# EAGLE design RH005.1 (EAGLE 7.1.0)
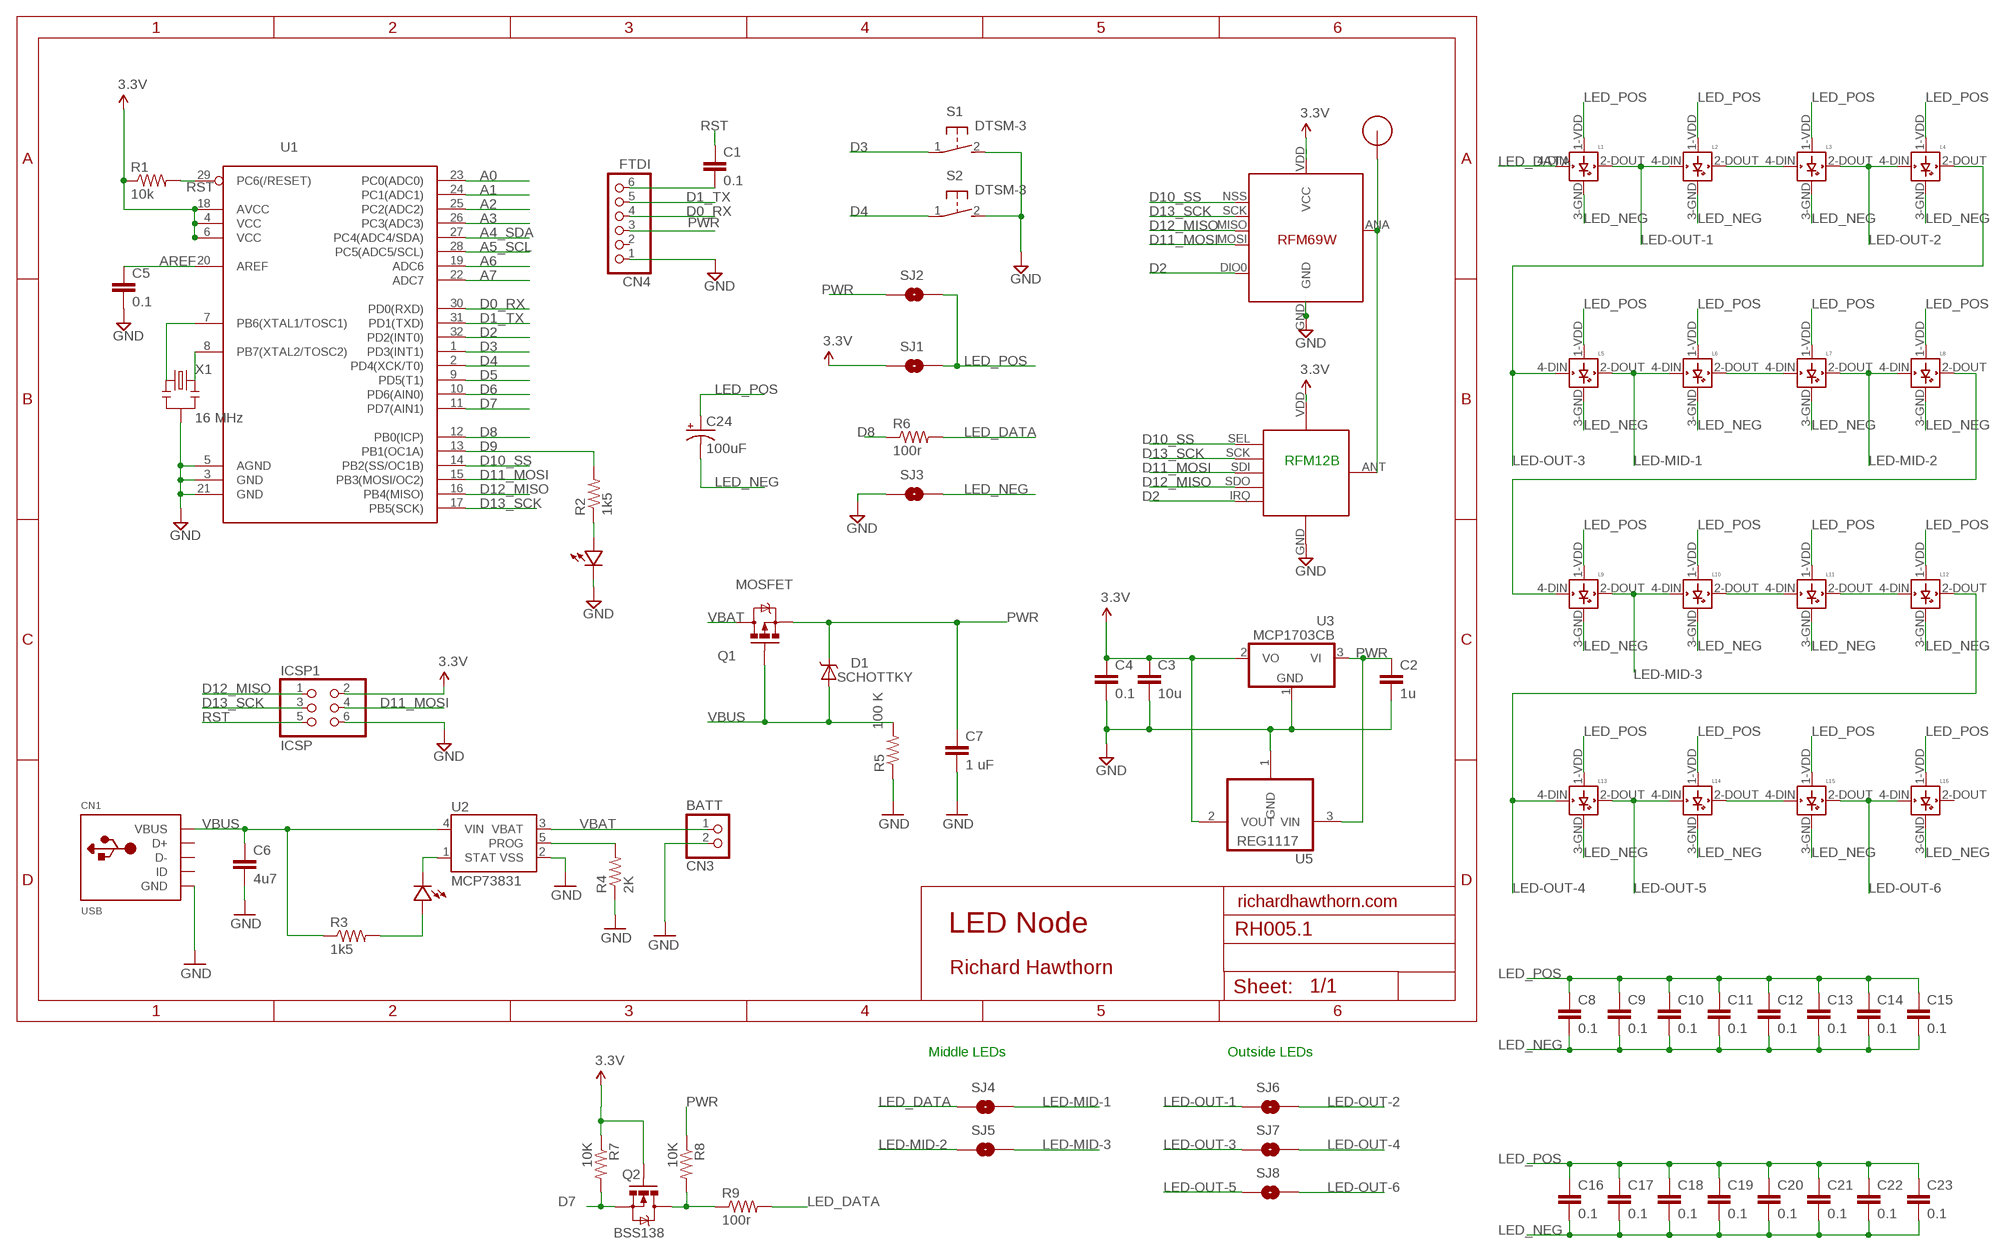
[diagram p0: schematic, sheet 1]

## Parts
C1  0.1  CAP0603-CAP  [0603-CAP]
C2  1u  CAP0603-CAP  [0603-CAP]
C3  10u  CAP0805-CAP  [0805-CAP]
C4  0.1  CAP0603-CAP  [0603-CAP]
C5  0.1  CAP0603-CAP  [0603-CAP]
C6  4u7  CAP0603-CAP  [0603-CAP]
C7  1 uF  CAP0805  [0805]
C8  0.1  CAP0603-CAP  [0603-CAP]
C9  0.1  CAP0603-CAP  [0603-CAP]
C10  0.1  CAP0603-CAP  [0603-CAP]
C11  0.1  CAP0603-CAP  [0603-CAP]
C12  0.1  CAP0603-CAP  [0603-CAP]
C13  0.1  CAP0603-CAP  [0603-CAP]
C14  0.1  CAP0603-CAP  [0603-CAP]
C15  0.1  CAP0603-CAP  [0603-CAP]
C16  0.1  CAP0603-CAP  [0603-CAP]
C17  0.1  CAP0603-CAP  [0603-CAP]
C18  0.1  CAP0603-CAP  [0603-CAP]
C19  0.1  CAP0603-CAP  [0603-CAP]
C20  0.1  CAP0603-CAP  [0603-CAP]
C21  0.1  CAP0603-CAP  [0603-CAP]
C22  0.1  CAP0603-CAP  [0603-CAP]
C23  0.1  CAP0603-CAP  [0603-CAP]
C24  100uF  100UF-10V-10%(TANT)  [EIA7343]
CN1  USB  USBMINIB  [USB-MINIB]
CN3  BATT  JST_2PIN-SMT-RA  [JST-PH-2-SMT-RA]
CN4  FTDI  PINHD-1X6  [1X06]
D1  SCHOTTKY  DIODE-SCHOTTKY_  [SMA-DIODE]
ICSP1  ICSP  PINHD-2X3  [2X03]
L1  WS2812B  [WS2812B]
L2  WS2812B  [WS2812B]
L3  WS2812B  [WS2812B]
L4  WS2812B  [WS2812B]
L5  WS2812B  [WS2812B]
L6  WS2812B  [WS2812B]
L7  WS2812B  [WS2812B]
L8  WS2812B  [WS2812B]
L9  WS2812B  [WS2812B]
L10  WS2812B  [WS2812B]
L11  WS2812B  [WS2812B]
L12  WS2812B  [WS2812B]
L13  WS2812B  [WS2812B]
L14  WS2812B  [WS2812B]
L15  WS2812B  [WS2812B]
L16  WS2812B  [WS2812B]
LED1  LED0603  [0603-LED]
LED2  LED0603  [0603-LED]
Q1  MOSFET  MOSFET-PCHANNELSMD  [SOT23-3]
Q2  BSS138  MOSFET-NCHANNELSMD  [SOT23-3]
R1  10k  RESISTOR0603-RES  [0603-RES]
R2  1k5  RESISTOR0603-RES  [0603-RES]
R3  1k5  RESISTOR0603-RES  [0603-RES]
R4  2K  RESISTOR0603-RES  [0603-RES]
R5  100 K  RESISTOR0805-RES  [0805]
R6  100r  RESISTOR0603-RES  [0603-RES]
R7  10K  RESISTOR0805-RES  [0805]
R8  10K  RESISTOR0805-RES  [0805]
R9  100r  RESISTOR0603-RES  [0603-RES]
RF1  RFM12B  RFM12B_MINPADS  [RFM12B-MINPADS]
RF2  RFM69  [RFM69W-MINPADS]
S1  DTSM-3  [DTSM-3]
S2  DTSM-3  [DTSM-3]
SJ1  SOLDERJUMPERNO  [SJ_2S-NO]
SJ2  SOLDERJUMPERNO  [SJ_2S-NO]
SJ3  SOLDERJUMPERNO  [SJ_2S-NO]
SJ4  JUMPER-PAD-2-NOYES_SILK  [PAD-JUMPER-2-NO_YES_SILK]
SJ5  JUMPER-PAD-2-NOYES_SILK  [PAD-JUMPER-2-NO_YES_SILK]
SJ6  JUMPER-PAD-2-NOYES_SILK  [PAD-JUMPER-2-NO_YES_SILK]
SJ7  JUMPER-PAD-2-NOYES_SILK  [PAD-JUMPER-2-NO_YES_SILK]
SJ8  JUMPER-PAD-2-NOYES_SILK  [PAD-JUMPER-2-NO_YES_SILK]
U1  ATMega-328  ATMEGA168/328TQFP32  [TQFP32-08]
U2  MCP73831  [SOT23-5]
U3  MCP1703CB  [SOT23]
U5  REG1117  [SOT223]
U$1  RFM12B_ANTENNA  [RFM12B-ANTENNA]
X1  16 MHz  RESONATORSMD  [RESONATOR-SMD]

## Nets
A0: U1.23(PC0(ADC0))
A1: U1.24(PC1(ADC1))
A2: U1.25(PC2(ADC2))
A3: U1.26(PC3(ADC3))
A4_SDA: U1.27(PC4(ADC4/SDA))
A5_SCL: U1.28(PC5(ADC5/SCL))
A6: U1.19(ADC6)
A7: U1.22(ADC7)
AREF: C5.1 U1.20(AREF)
D0_RX: CN4.4 U1.30(PD0(RXD))
D1_TX: CN4.5 U1.31(PD1(TXD))
D2: RF1.IRQ RF2.DIO0 U1.32(PD2(INT0))
D3: S1.1 U1.1(PD3(INT1))
D4: S2.1 U1.2(PD4(XCK/T0))
D5: U1.9(PD5(T1))
D6: U1.10(PD6(AIN0))
D7: Q2.2(S) R7.2 U1.11(PD7(AIN1))
D8: R6.1 U1.12(PB0(ICP))
D9: R2.2 U1.13(PB1(OC1A))
D10_SS: RF1.SEL RF2.NSS(SEL) U1.14(PB2(SS/OC1B))
D11_MOSI: ICSP1.4 RF1.SDI(SDI/MOSI) RF2.MOSI U1.15(PB3(MOSI/OC2))
D12_MISO: ICSP1.1 RF1.SDO(SDO/MISO) RF2.MISO U1.16(PB4(MISO))
D13_SCK: ICSP1.3 RF1.SCK RF2.SCK U1.17(PB5(SCK))
GND [power]: C2.2 C3.2 C4.2 C5.2 C6.2 C7.2 CN1.GND CN3.2 CN4.1 ICSP1.6 LED2.MINUS R4.1 R5.1 RF1.GND RF2.GND S1.2 S2.2 SJ3.1 U1.3(GND) U1.5(AGND) U1.21(GND) U2.2(VSS) U3.1(GND) U5.1(GND) X1.2
HV_LED: Q2.3(D) R8.2 R9.1
LED-MID-1: L5.2-DOUT(DOUT) L6.4-DIN(DIN) SJ4.2
LED-MID-2: L7.2-DOUT(DOUT) L8.4-DIN(DIN) SJ5.1
LED-MID-3: L9.2-DOUT(DOUT) L10.4-DIN(DIN) SJ5.2
LED-OUT-1: L1.2-DOUT(DOUT) L2.4-DIN(DIN) SJ6.1
LED-OUT-2: L3.2-DOUT(DOUT) L4.4-DIN(DIN) SJ6.2
LED-OUT-3: L4.2-DOUT(DOUT) L5.4-DIN(DIN) SJ7.1
LED-OUT-4: L12.2-DOUT(DOUT) L13.4-DIN(DIN) SJ7.2
LED-OUT-5: L13.2-DOUT(DOUT) L14.4-DIN(DIN) SJ8.1
LED-OUT-6: L15.2-DOUT(DOUT) L16.4-DIN(DIN) SJ8.2
LED_DATA: L1.4-DIN(DIN) R6.2 R9.2 SJ4.1
LED_NEG [power]: C8.2 C9.2 C10.2 C11.2 C12.2 C13.2 C14.2 C15.2 C16.2 C17.2 C18.2 C19.2 C20.2 C21.2 C22.2 C23.2 C24.C(-) L1.3-GND(GND) L2.3-GND(GND) L3.3-GND(GND) L4.3-GND(GND) L5.3-GND(GND) L6.3-GND(GND) L7.3-GND(GND) L8.3-GND(GND) L9.3-GND(GND) L10.3-GND(GND) L11.3-GND(GND) L12.3-GND(GND) L13.3-GND(GND) L14.3-GND(GND) L15.3-GND(GND) L16.3-GND(GND) SJ3.2
LED_POS [power]: C8.1 C9.1 C10.1 C11.1 C12.1 C13.1 C14.1 C15.1 C16.1 C17.1 C18.1 C19.1 C20.1 C21.1 C22.1 C23.1 C24.A(+) L1.1-VDD(VDD) L2.1-VDD(VDD) L3.1-VDD(VDD) L4.1-VDD(VDD) L5.1-VDD(VDD) L6.1-VDD(VDD) L7.1-VDD(VDD) L8.1-VDD(VDD) L9.1-VDD(VDD) L10.1-VDD(VDD) L11.1-VDD(VDD) L12.1-VDD(VDD) L13.1-VDD(VDD) L14.1-VDD(VDD) L15.1-VDD(VDD) L16.1-VDD(VDD) SJ1.2 SJ2.2
N$1: U1.7(PB6(XTAL1/TOSC1)) X1.1
N$2: LED2.PLUS R2.1
N$3: RF1.ANT RF2.ANA(ANT) U$1.P$1
N$4: LED1.PLUS R3.2
N$6: L2.2-DOUT(DOUT) L3.4-DIN(DIN)
N$10: L6.2-DOUT(DOUT) L7.4-DIN(DIN)
N$12: L8.2-DOUT(DOUT) L9.4-DIN(DIN)
N$14: L10.2-DOUT(DOUT) L11.4-DIN(DIN)
N$15: L11.2-DOUT(DOUT) L12.4-DIN(DIN)
N$18: L14.2-DOUT(DOUT) L15.4-DIN(DIN)
N$20: C1.2 CN4.6
N$21: U1.8(PB7(XTAL2/TOSC2)) X1.3
PROG: R4.2 U2.5(PROG)
PWR [power]: C2.1 C7.1 CN4.3 D1.C Q1.2(S) R8.1 SJ2.1 U3.3(VI) U5.3(VIN)
RST: C1.1 ICSP1.5 R1.2 U1.29(PC6(/RESET))
STAT: LED1.MINUS U2.1(STAT)
VBAT: CN3.1 Q1.3(D) U2.3(VBAT)
VBUS [power]: C6.1 CN1.VBUS D1.A Q1.1(G) R3.1 R5.2 U2.4(VIN)
VCC: C3.1 C4.1 ICSP1.2 Q2.1(G) R1.1 R7.1 RF1.VDD RF2.VDD(VCC) SJ1.1 U1.4(VCC) U1.6(VCC) U1.18(AVCC) U3.2(VO) U5.2(VOUT) ; supply symbol labelled 3.3V
Unconnected: CN1.D+ CN1.D- CN1.ID CN4.2 L16.2-DOUT(DOUT)

## Notes on the sheet
- RFM12B
- richardhawthorn.com
- LED Node
- Richard Hawthorn
- Middle LEDs | Outside LEDs

## Library data of the parts
C1-C5 C8-C23 = LowPowerLab:CAP: Capacitor Standard 0603 ceramic capacitor, and 0.1" leaded capacitor.
C6 = SparkFun:CAP: Capacitor Standard 0603 ceramic capacitor, and 0.1" leaded capacitor.
C7 = SparkFun-Capacitors:CAP: Capacitor Standard 0603 ceramic capacitor, and 0.1" leaded capacitor.
C24 = SparkFun-Capacitors:100UF-10V-10%(TANT): CAP-07890; PROD_ID: CAP-07890
CN1 = LowPowerLab:USB: USB Connectors USBMINIB - Surface Mount Female Mini-B USB Connector 4UConnector: 06564 By microbuilder.eu Thru-hole RA Female Mini-B USB Connector 4UConnector: 18732 By ladyada.net
CN3 = adafruit:JST_2PIN: JST 2-Pin Connectors of various flavors SMT-RA (S2B-PH-SM4) 4UConnector #17311 SMT (B2B-PH-SM4) THM-RA (S2B-PH) THM (B2B-PH)
CN4 = pinhead:PINHD-1X6: PIN HEADER
D1 = SparkFun-DiscreteSemi:DIODE-SCHOTTKY: Commonly MBRA140.
ICSP1 = pinhead:PINHD-2X3: PIN HEADER
L1-L16 = adafruit:WS2812B
LED1 LED2 = LowPowerLab:LED
Q1 = SparkFun-DiscreteSemi:MOSFET-PCHANNEL: Generic PMOSFET
Q2 = SparkFun:MOSFET-NCHANNEL
R1-R4 R6 R9 = LowPowerLab:RESISTOR: Resistor Basic schematic elements and footprints for 0603, 1206, and PTH resistors.
R5 = SparkFun-Resistors:RESISTOR: Resistor Basic schematic elements and footprints for 0603, 1206, and PTH resistors.
R7 R8 = SparkFun-Passives:RESISTOR: Resistor Basic schematic elements and footprints for 0603, 1206, and PTH resistors.
RF1 = LowPowerLab:RFM12B_MINPADS
RF2 = LowPowerLab:RFM69
S1 S2 = switch-tact:DTSM-3
SJ1-SJ3 = SparkFun-Retired:SOLDERJUMPER: Solder Jumper Standard SMD solder jumper. Used to automate production. Two varients : Normally Open and Normally Closed are the same, but have different paste layers. NC will have a large amount of paste and should jumper during reflow.
SJ4-SJ8 = SparkFun-Passives:JUMPER-PAD-2-NO
U1 = LowPowerLab:ATMEGA168/328: Atmel 32-pin 8-bit micro, 16k flash.
U2 = SparkFun:MCP73831: Microchip's MCP73831 Miniature single cell, fully integrated Li-Ion, Li-polymer charge management controller http://ww1.microchip.com/downloads/en/DeviceDoc/21984a.pdf
U3 = linear:MCP1703: 250 mA, 16V, Low Quiescent Current LDO Regulator Source: http://ww1.microchip.com/downloads/en/DeviceDoc/22049b.pdf
U5 = burr-brown:REG1117: 800mA and 1A Low Dropout (LDO) Positive Regulator 1.8V, 2.5V, 2.85V, 3.3V, 5V, and Adj; MPN: REG1117; OC_FARNELL: 1097566; OC_NEWARK: 14P6981
U$1 = LowPowerLab:RFM12B_ANTENNA
X1 = SparkFun:RESONATOR: Resonator Small SMD resonator. This is the itty bitty 10/20MHz resonators with built in caps. CSTCE10M0G55 and CSTCE20M0V53. Footprint has been reviewed closely but hasn't been tested yet.

## Net classes
1 power: width 0.381 mm, clearance 0.254 mm

## Board
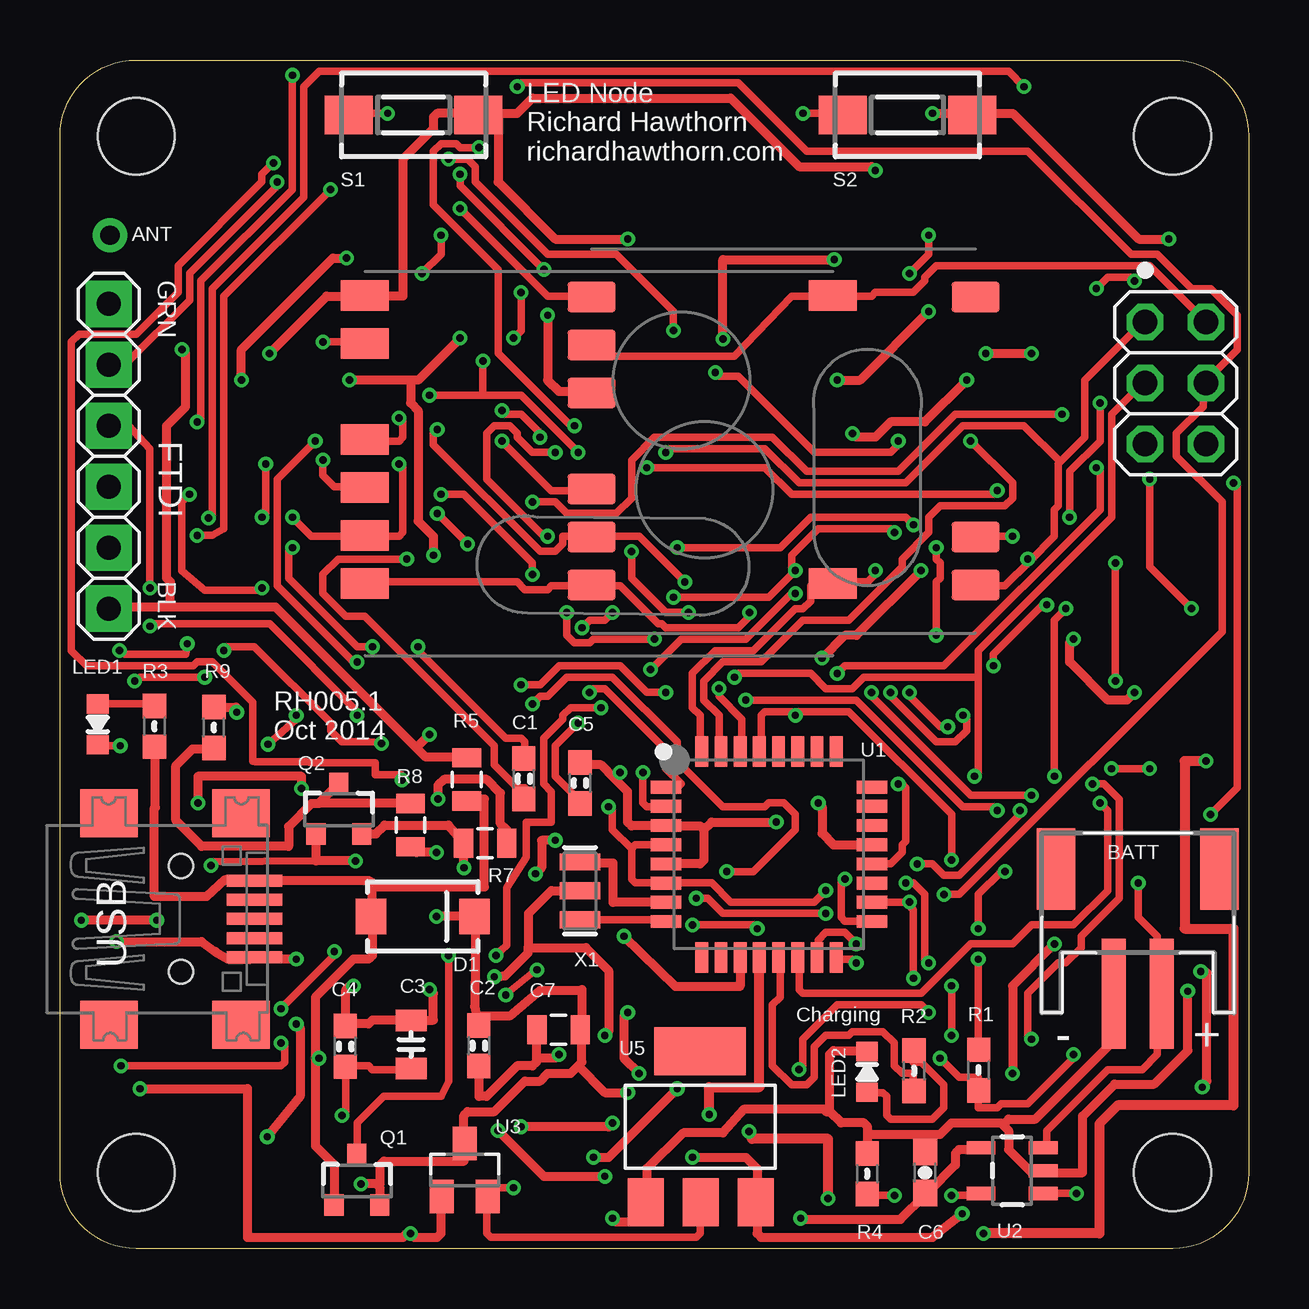
[diagram p1: board, top side]
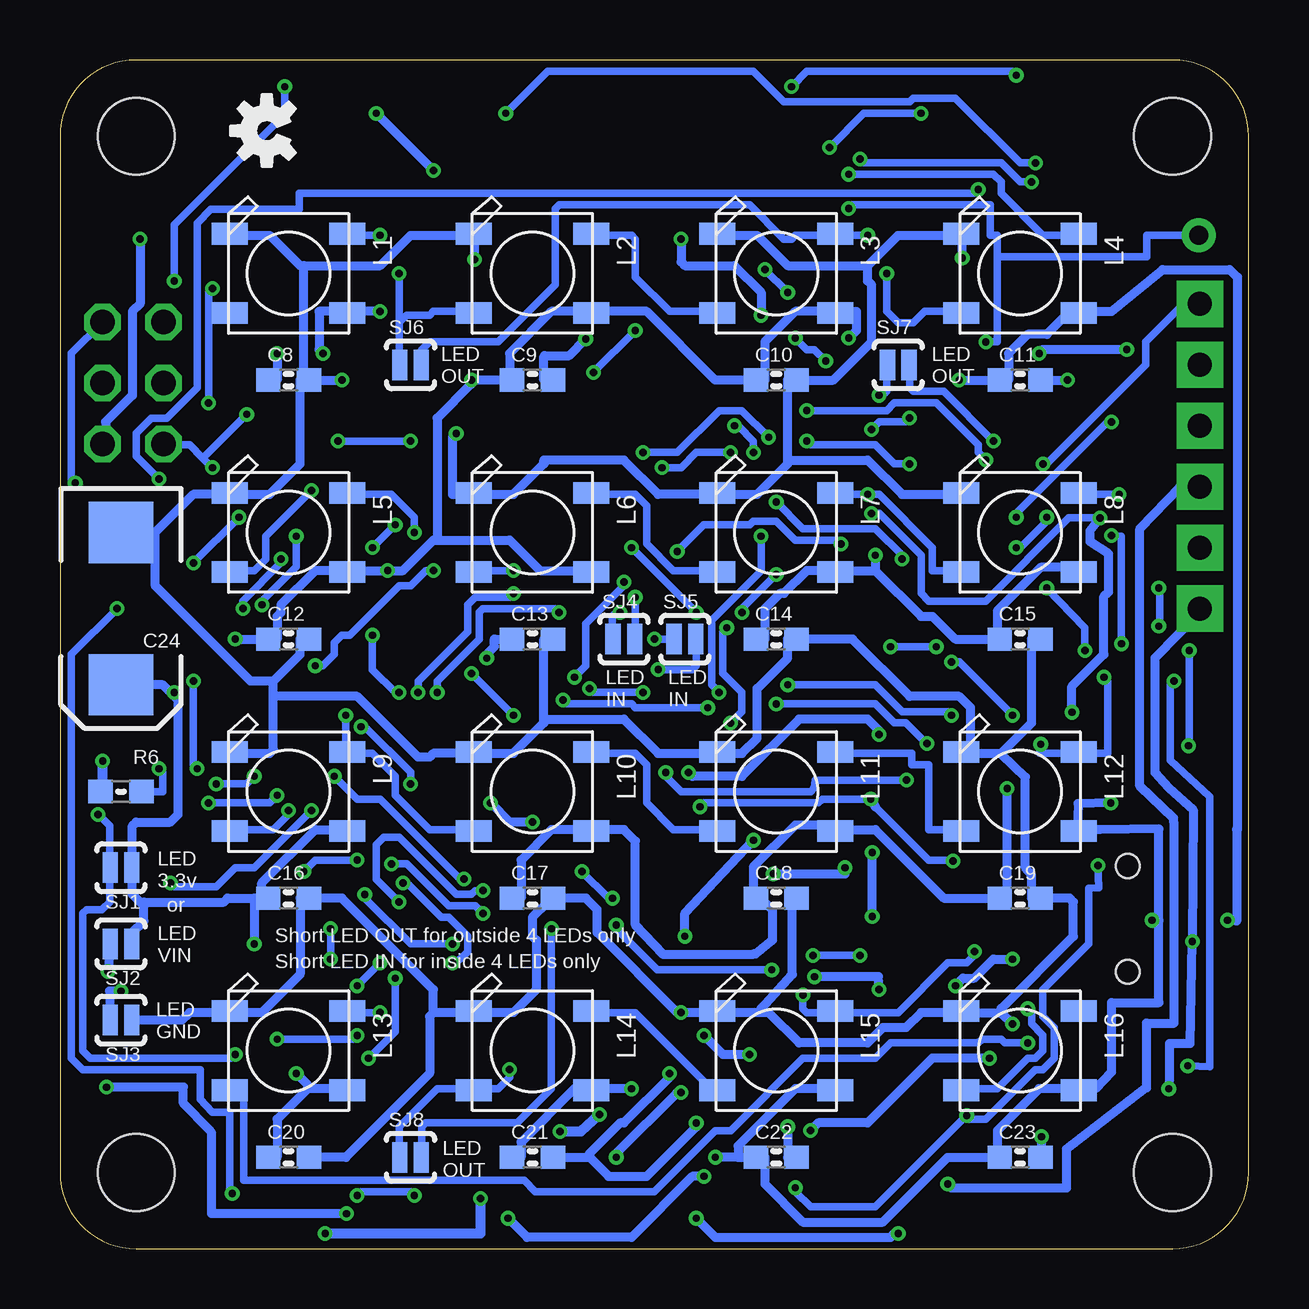
[diagram p2: board, bottom side, seen from below]

Size 49.53 x 49.53 mm. Coordinates in mm from the lower left corner, seen from the top.
Outline: 46.35,0 3.17,0 arc-90 0,3.17 0,46.35 arc-90 3.17,49.53 46.35,49.53 arc-90 49.53,46.35 49.53,3.17 arc-90 46.35,0
Copper layers (1*16): Top 0.035mm / dielectric 1.5mm / Bottom 0.035mm
Design rules "ITEADstudio_DRC *": minimum track width 12mil, minimum drill 12mil, track to track 6mil, track to pad 6mil, pad to pad 6mil, via to via 6mil, smd to smd 0mil, copper to edge 10mil, drill to drill 10mil, minimum pad ring 10mil, minimum via ring 6mil, stop-mask expansion 2mil, vias tented up to drill 100mil, thermal gap 15mil
Holes 3.2 mm at 3.17,3.17 46.35,3.17 3.17,46.35 46.35,46.35
tKeepout: area 0,43.8 to 5.7,49.5; area 43.8,43.8 to 49.5,49.5; area 43.8,0 to 49.5,5.7; area 0,0 to 5.7,5.7
bKeepout: area 0,0 to 5.7,5.7; area 0,43.8 to 5.7,49.5; area 43.8,43.8 to 49.5,49.5; area 43.8,0 to 49.5,5.7
tRestrict: area 24.3,8.9 to 29.1,12.8; area 5.8,16.9 to 6.9,18.5; area 5.2,9.7 to 6.7,10.4
bRestrict: area 27.4,17.7 to 29.2,18.7; area 21.1,13.8 to 22.9,14.9; area 21.6,12.6 to 22.1,13.2; area 20.7,12.6 to 21.2,13.2; area 20.2,12.8 to 20.7,13.5; area 20.1,13.4 to 20.6,14; area 26.5,18.9 to 27.1,19.5; area 26.5,17.9 to 27.1,18.5; area 27.5,19.1 to 28,19.8; area 27.9,18.8 to 29.1,19.6

### Footprints (pad centres in the part's own frame; a part is rotated, then mirrored left to right if it is on the bottom)
0603-CAP = smd 1.016 x 0.965: 1 -0.85,0; 2 0.85,0
0805-CAP = smd 0.902 x 1.3: 1 -1,0; 2 1,0
0603-CAP' = smd 1.1 x 1: 1 -0.85,0; 2 0.85,0
0805 = smd 0.8 x 1.2: 1 -0.9,0; 2 0.9,0
EIA7343 = smd 2.55 x 2.7: A 3.17,0; C -3.17,0
USB-MINIB = smd 0.5 x 2.308: D+ 0,4.064; D- -0.8,4.064; GND 1.6,4.064; ID 0.8,4.064; VBUS -1.6,4.064 | smd 2 x 2.4: GND1 -4.4,-2; GND2 -4.4,3.5; GND3 4.4,3.5; GND4 4.4,-2 | hole 1: -2.2,1; 2.2,1
JST-PH-2-SMT-RA = smd 1 x 4.6: 1 1,-3.7; 2 -1,-3.7 | smd 1.6 x 3.4: NC1 -3.4,1.5; NC2 3.4,1.5
1X06 = drill 1 pad 1.93 square: 1 -6.35,0; 2 -3.81,0; 3 -1.27,0; 4 1.27,0; 5 3.81,0; 6 6.35,0
SMA-DIODE = smd 1.27 x 1.47: A -2.15,0; C 2.15,0
2X03 = drill 1.016 octagon: 1 -2.54,-1.27; 2 -2.54,1.27; 3 0,-1.27; 4 0,1.27; 5 2.54,-1.27; 6 2.54,1.27
WS2812B = smd 1.5 x 0.9: 1-VDD 2.45,-1.65; 2-DOUT 2.45,1.65; 3-GND -2.45,1.65; 4-DIN -2.45,-1.65
0603-LED = smd 0.8 x 0.9: MINUS -0.85,0; PLUS 0.85,0
SOT23-3 = smd 0.8 x 0.9: 1 -0.95,-1; 2 0.95,-1; 3 0,1.1
0603-RES = smd 1.016 x 0.965: 1 -0.85,0; 2 0.85,0
RFM12B-MINPADS = smd 2 x 1.27: ANT 8,-6; GND 8,-2; IRQ -8,4; SCK 8,4; SDI 8,2; SDI1 -8.002,-6.001; SDO -8,6; SEL 8,6; VDD 8,-4
RFM69W-MINPADS = smd 2 x 1.27: ANA 8,-5; DIO0 -11.5,5; GND 8,-7; MISO 8,1; MOSI 8,3; NSS 8,5; SCK 8,-1; VDD -11.5,-7
DTSM-3 = smd 2 x 1.6: 1 -2.7,0; 2 2.7,0
SJ_2S-NO = smd 0.635 x 1.27: 1 -0.45,0; 2 0.45,0
PAD-JUMPER-2-NO_YES_SILK = smd 0.635 x 1.27: 1 -0.45,0; 2 0.45,0
TQFP32-08 = smd 1.27 x 0.533: 1 -4.293,2.8; 2 -4.293,2; 3 -4.293,1.2; 4 -4.293,0.4; 5 -4.293,-0.4; 6 -4.293,-1.2; 7 -4.293,-2; 8 -4.293,-2.8; 17 4.293,-2.8; 18 4.293,-2; 19 4.293,-1.2; 20 4.293,-0.4; 21 4.293,0.4; 22 4.293,1.2; 23 4.293,2; 24 4.293,2.8 | smd 0.533 x 1.27: 9 -2.8,-4.293; 10 -2,-4.293; 11 -1.2,-4.293; 12 -0.4,-4.293; 13 0.4,-4.293; 14 1.2,-4.293; 15 2,-4.293; 16 2.8,-4.293; 25 2.8,4.293; 26 2,4.293; 27 1.2,4.293; 28 0.4,4.293; 29 -0.4,4.293; 30 -1.2,4.293; 31 -2,4.293; 32 -2.8,4.293
SOT23-5 = smd 0.55 x 1.2: 1 -0.95,-1.3; 2 0,-1.3; 3 0.95,-1.3; 4 0.95,1.3; 5 -0.95,1.3
SOT23 = smd 1 x 1.4: 1 -0.95,-1.1; 2 0.95,-1.1; 3 0,1.1
SOT223 = smd 1.499 x 2.007: 1 -2.261,-3.15; 2 0.025,-3.15; 3 2.311,-3.15 | smd 3.81 x 2.007: 4 0,3.15
RFM12B-ANTENNA = drill 0.8 pad 1.422: P$1 0,0
RESONATOR-SMD = smd 0.7 x 1.7: 1 -1.2,0; 2 0,0; 3 1.2,0

### Placement (x,y rotation side)
C1  19.33,19.58 90 top
C2  17.45,8.46 270 top
C3  14.63,8.51 90 top
C4  11.89,8.43 90 top
C5  21.67,19.41 90 top
C6  4u7  [0603-CAP']  36.04,3.17 90 top
C7  20.78,9.12 180 top
C8  40.01,36.2 0 bottom
C9  29.84,36.2 0 bottom
C10  19.68,36.2 0 bottom
C11  9.53,36.2 0 bottom
C12  40.01,25.4 0 bottom
C13  29.84,25.4 0 bottom
C14  19.68,25.4 0 bottom
C15  9.53,25.4 0 bottom
C16  40.01,14.61 0 bottom
C17  29.84,14.61 0 bottom
C18  19.68,14.61 0 bottom
C19  9.53,14.61 0 bottom
C20  40.01,3.81 0 bottom
C21  29.84,3.81 0 bottom
C22  19.68,3.81 0 bottom
C23  9.53,3.81 0 bottom
C24  46.99,26.67 270 bottom
CN1  4.04,13.74 270 top
CN3  44.91,14.33 0 top
CN4  2.03,33.02 90 top
D1  15.11,13.84 0 top
ICSP1  46.48,36.07 270 top
L1  40.01,40.64 0 bottom
L2  29.84,40.64 0 bottom
L3  19.68,40.64 0 bottom
L4  9.53,40.64 0 bottom
L5  40.01,29.84 0 bottom
L6  29.84,29.84 0 bottom
L7  19.68,29.84 0 bottom
L8  9.53,29.84 0 bottom
L9  40.01,19.05 0 bottom
L10  29.84,19.05 0 bottom
L11  19.68,19.05 0 bottom
L12  9.53,19.05 0 bottom
L13  40.01,8.26 0 bottom
L14  29.84,8.26 0 bottom
L15  19.68,8.26 0 bottom
L16  9.53,8.26 0 bottom
LED1  1.57,21.84 90 top
LED2  33.63,7.37 270 top
Q1  12.37,2.82 0 top
Q2  11.62,18.29 0 top
R1  38.28,7.44 90 top
R2  35.59,7.42 270 top
R3  3.94,21.77 90 top
R4  33.63,3.12 270 top
R5  16.94,19.56 270 top
R6  46.99,19.05 0 bottom
R7  17.72,16.89 180 top
R8  14.61,17.65 90 top
R9  6.41,21.72 90 top
RF1  30.15,33.66 180 top
RF2  20.7,32.72 180 top
S1  14.73,47.24 0 top
S2  35.31,47.24 0 top
SJ1  46.99,15.88 0 bottom
SJ2  46.99,12.7 0 bottom
SJ3  46.99,9.53 0 bottom
SJ4  26.04,25.4 0 bottom
SJ5  23.5,25.4 0 bottom
SJ6  34.92,36.83 0 bottom
SJ7  14.61,36.83 0 bottom
SJ8  34.92,3.81 0 bottom
U1  29.54,16.43 0 top
U2  39.67,3.25 90 top
U3  16.87,3.28 0 top
U5  26.67,5.08 0 top
U$1  2.08,42.23 0 top
U$3  [OSHW-LOGO-S]  40.92,46.58 90 bottom
X1  21.67,14.91 270 top

### Tracks (layer width: path | path; a pad name or v marks a point on that pad's centre or on a via)
AREF  (via drill 0.3)
  Top 0.305: v34.92,19.37 35.08,19.37 35.24,19.21 35.24,16.99 35.08,16.83 35.08,16.51 34.61,16.03 33.97,16.03 U1.20 | v36.99,21.75 36.67,21.75 35.4,23.02 v35.4,23.18 | v36.51,25.56 36.51,27.78 36.67,27.94 36.67,28.57 36.51,28.73 v36.51,29.21 | v35.56,30.16 35.24,30.48 31.27,30.48 30,29.21 v25.72,29.21 | v23.02,26.51 22.7,26.19 22.07,26.19 v21.75,25.88 | v21.59,21.91 20.64,20.95 20.64,19.68 21.75,18.57 C5.1
  Bottom 0.305: v34.92,19.37 34.92,19.84 36.83,21.75 v36.99,21.75 | v35.4,23.18 35.56,23.18 36.51,24.13 v36.51,25.56 | v35.56,30.16 v36.51,29.21 | v23.02,26.51 v25.72,29.21 | v21.75,25.88 21.91,25.72 21.91,23.97 21.11,23.18 21.11,22.38 v21.59,21.91
D0_RX  (via drill 0.3)
  Top 0.305: CN4.4 2.86,34.29 3.75,33.34 v3.75,27.53 | v3.75,25.94 3.97,26.04 8.73,26.04 12.38,22.38 v12.38,22.23 | v19.21,23.5 20,23.5 20.8,24.29 23.34,24.29 24.45,23.18 v25.24,23.18 | v27.46,23.34 27.46,23.02 28.42,22.07 28.42,20.8 U1.30
  Bottom 0.305: v3.75,27.53 3.71,27.3 3.71,26.04 v3.75,25.94 | v12.38,22.23 12.54,22.38 14.45,22.38 15.56,23.5 v19.21,23.5 | v25.24,23.18 27.3,23.18 v27.46,23.34
D1_TX  (via drill 0.3)
  Top 0.305: CN4.5 2.7,36.83 5.4,39.53 5.4,40.64 9.05,44.29 v9.05,44.45 | v16.19,45.4 16.99,45.4 17.3,45.09 17.3,44.45 20.32,41.43 23.18,41.43 25.56,39.05 v25.56,38.26 | v27.3,36.51 27.46,36.35 28.26,36.35 31.43,33.18 34.61,33.18 34.92,33.5 v34.92,33.66 | v37.94,33.66 39.69,31.91 39.69,31.27 39.37,30.96 36.67,30.96 36.2,30.48 36.2,29.84 35.08,28.73 35.08,28.42 32.86,26.19 30.96,26.19 29.21,24.45 27.62,24.45 26.83,23.65 26.83,22.86 27.46,22.23 27.46,20.8 U1.31
  Bottom 0.305: v9.05,44.45 9.53,44.45 10.32,45.24 16.03,45.24 v16.19,45.4 | v27.3,36.51 v25.56,38.26 | v37.94,33.66 v34.92,33.66
D2  (via drill 0.3)
  Top 0.305: v33.97,28.26 33.97,28.1 33.66,27.78 32.23,27.78 RF2.DIO0 32.07,27.78 31.43,27.78 31.27,27.62 31.27,26.99 30.96,26.67 30.64,26.67 28.89,24.92 27.3,24.92 26.35,23.97 26.35,22.54 26.67,22.23 26.67,20.8 U1.32 | v38.89,24.29 38.89,24.77 40.96,26.83 v41.12,26.83 | v39.69,29.69 38.26,29.69 RF1.IRQ
  Bottom 0.305: v33.97,28.26 34.29,28.26 34.92,27.62 35.4,27.62 37.47,25.56 37.78,25.56 38.1,25.24 38.1,24.77 38.58,24.29 v38.89,24.29 | v41.12,26.83 41.12,26.99 39.69,28.42 v39.69,29.69
D3  (via drill 0.3)
  Top 0.305: v13.65,47.31 12.06,47.31 S1.1 | v17.46,45.88 16.67,45.88 16.51,46.04 15.88,46.04 15.56,45.72 15.56,43.5 18.26,40.8 18.26,37.31 21.27,34.29 v21.43,34.29 | v20.64,33.18 19.68,33.18 19.05,33.81 19.05,33.97 18.73,34.29 18.1,34.29 17.78,33.97 17.78,32.07 20.16,29.69 v20.32,29.69 | v22.07,23.18 22.23,23.34 22.7,23.34 25.24,20.8 25.24,20 25.88,19.37 25.72,19.21 25.4,19.21 U1.1
  Bottom 0.305: v13.65,47.31 16.03,47.31 v17.46,45.88 | v21.43,34.29 21.27,34.29 20.64,33.66 v20.64,33.18 | v20.32,29.69 20.32,28.26 22.38,26.19 22.38,23.5 v22.07,23.18
D4  (via drill 0.3)
  Top 0.305: v30.96,47.31 32.54,47.31 S2.1 | v8.89,45.24 8.41,44.77 8.41,44.45 4.92,40.96 4.92,39.85 3.17,38.1 0.79,38.1 0.48,37.78 0.48,24.92 1.11,24.29 5.56,24.29 5.71,24.45 6.35,24.45 8.03,22.77 8.03,20.32 8.13,20.29 10.26,20.29 10.48,20.26 13.14,20.26 13.14,19.75 14.22,19.75 v14.26,19.53 | v24.29,19.84 24.29,18.57 24.45,18.41 25.24,18.41 U1.2
  Bottom 0.305: v30.96,47.31 29.21,49.05 20.64,49.05 19.37,47.78 14.13,47.78 13.97,47.94 12.22,47.94 9.53,45.24 v8.89,45.24 | v14.26,19.53 18.07,19.53 18.1,19.21 18.26,19.05 23.65,19.05 24.29,19.68 v24.29,19.84
D7  (via drill 0.3)
  Top 0.381: Q2.2 13.16,17.29 13.53,17.65 16.18,17.65 R7.2 v16.83,15.88 | U1.11 28.34,10.94 28.32,10.92 25.65,10.92 v23.5,13.02 | v20.64,17.02 20.07,17.02 20.07,15.88 v19.81,15.62
  Bottom 0.381: v23.5,13.02 23.5,13.97 v20.64,17.02 | v19.81,15.62 16.83,15.62 v16.83,15.88
D8  (via drill 0.3)
  Top 0.406: v47.75,20.32 46.86,20.32 46.86,13.34 48.9,13.34 48.9,5.97 44.07,5.97 43.31,5.21 43.31,0.64 v38.48,0.64 | v32,2.1 32,4.57 28.83,4.57 v28.7,4.89 | v27.05,5.59 27.05,6.73 29.14,6.73 U1.12
  Bottom 0.406: R6.1 47.75,19.05 v47.75,20.32 | v38.48,0.64 32,0.64 v32,2.1 | v28.7,4.89 27.81,4.89 v27.05,5.59
D9
  Top 0.305: R2.2 35.56,6.67 35.56,7.3 35.08,7.3 34.77,7.62 34.77,8.57 34.29,9.05 33.02,9.05 32.86,8.89 31.91,8.89 31.43,8.41 31.43,7.14 31.11,6.83 30.48,6.83 29.69,7.62 29.69,10.16 30,10.48 30,12.06 U1.13
D10_SS  (via drill 0.3)
  Top 0.305: v43.34,18.57 43.66,18.26 43.66,14.92 42.23,13.49 40.48,13.49 39.69,12.7 37.94,12.7 35.88,10.64 30.96,10.64 30.8,10.79 30.8,12.06 U1.14 | v40.48,18.89 37.94,18.89 33.81,23.02 v33.81,23.18 | v28.73,26.51 28.73,26.35 28.26,25.88 25.24,25.88 25.08,26.04 24.92,26.04 23.34,27.62 22.23,27.62 RF1.SEL 22.07,27.62 20.48,27.62 20.32,27.46 19.37,27.46 19.05,27.78 12.86,27.78 RF2.NSS
  Bottom 0.305: v43.34,18.57 40.8,18.57 v40.48,18.89 | v33.81,23.18 33.81,23.65 32.07,25.4 32.07,26.51 31.91,26.67 28.89,26.67 v28.73,26.51
D11_MOSI  (via drill 0.3)
  Top 0.305: v14.13,32.7 14.29,32.54 14.29,29.84 14.13,29.69 12.86,29.69 RF2.MOSI 12.54,29.69 10.48,29.69 v9.68,30.48 | v18.41,33.66 20.48,31.59 22.07,31.59 RF1.SDI | v33.18,12.7 32.7,13.18 31.91,13.18 31.59,12.86 31.59,12.22 U1.15 | v36.83,14.76 37.47,14.76 48.42,25.72 48.42,31.11 46.51,33.02 46.51,33.97 47.62,35.08 47.62,36.04 ICSP1.4 47.78,36.2 49.05,37.47 49.05,38.89 47.94,40.01 47.15,40.01 45.72,41.43 44.64,41.43 40.32,45.72 31.11,45.72 28.26,48.58 19.21,48.58 v19.05,48.42 | v5.71,34.45 5.87,34.61 5.87,40.32 9.68,44.13 v9.68,48.9
  Bottom 0.305: v14.13,32.7 14.76,32.7 15.56,33.5 18.26,33.5 v18.41,33.66 | v33.18,12.7 34.92,12.7 36.83,14.61 v36.83,14.76 | v9.68,30.48 9.68,30.64 5.87,34.45 v5.71,34.45 | v9.68,48.9 9.84,49.05 18.41,49.05 v19.05,48.42
D12_MISO  (via drill 0.3)
  Top 0.305: 41.67,32.78 41.59,32.7 41.59,30.96 41.43,30.8 41.43,29.69 40.4,28.65 | 41.67,32.78 42.7,33.81 42.7,36.2 45.09,38.58 ICSP1.1 | 40.4,28.65 39.37,27.62 38.26,27.62 RF1.SDO | v33.18,11.91 33.02,12.06 32.38,12.06 U1.16 | v35.24,15.24 35.56,15.24 36.04,14.76 36.04,12.06 v36.2,11.91 | v37.15,8.89 v37.15,10.95 | v40.48,8.73 40.32,8.89 40.32,10.64 41.59,11.91 41.91,11.91 42.55,12.54 42.55,13.02 44.13,14.61 44.13,18.73 43.5,19.37 v43.02,19.37 | v41.43,19.68 41.43,26.19 v41.91,26.67 | v40.32,28.73 40.4,28.65 | v10.95,32.86 10.95,32.23 11.43,31.75 12.7,31.75 RF2.MISO | v18.41,34.92 18.57,34.77 19.21,34.77 20,33.97 v20,33.81 | v25.24,33.18 25.4,33.34 29.37,33.34 30.8,31.91 35.24,31.91 37.62,34.29 40.16,34.29 41.67,32.78
  Bottom 0.305: v33.18,11.91 33.02,11.91 32.54,12.38 32.54,13.02 33.34,13.81 33.66,13.81 35.08,15.24 v35.24,15.24 | v37.15,10.95 v36.2,11.91 | v37.15,8.89 37.31,8.73 v40.48,8.73 | v43.02,19.37 41.75,19.37 v41.43,19.68 | v41.91,26.67 41.91,26.99 40.32,28.57 v40.32,28.73 | v10.95,32.86 11.27,33.18 11.27,33.5 13.02,35.24 14.76,35.24 15.08,34.92 v18.41,34.92 | v20,33.81 21.11,34.92 22.07,34.92 23.81,33.18 v25.24,33.18
D13_SCK  (via drill 0.3)
  Top 0.305: v15.72,34.13 15.56,33.97 15.56,33.5 20,29.05 20.64,29.05 20.95,29.37 20.95,29.69 22.07,29.69 RF1.SCK 22.23,29.69 24.13,29.69 v26.04,27.78 | v14.13,34.61 14.29,34.45 14.29,33.81 14.13,33.66 12.86,33.66 RF2.SCK | 38.26,23.81 38.26,19.84 v38.1,19.68 | 38.26,23.81 38.26,24.92 43.81,30.48 43.81,34.77 45.09,36.04 ICSP1.3 | v32.7,15.4 32.54,15.24 32.54,13.81 32.7,13.65 33.81,13.65 U1.17 | v28.1,23.81 28.26,23.97 31.27,23.97 31.91,23.34 33.02,23.34 33.5,23.81 38.26,23.81
  Bottom 0.305: v15.72,34.13 15.4,34.45 14.29,34.45 v14.13,34.61 | v38.1,19.68 37.15,18.73 36.2,18.73 32.86,15.4 v32.7,15.4 | v26.04,27.78 26.04,27.62 27.62,26.04 27.62,24.29 v28.1,23.81
GND  (via drill 0.3)
  Top 0.381: 12.7,39.69 RF2.GND | v20.32,38.89 20.32,36.2 20.8,35.72 22.07,35.72 RF1.GND | v23.65,42.07 20.64,42.07 18.26,44.45 18.26,47.15 18.1,47.31 17.46,47.31 S1.2 | RF2.GND 12.86,39.69 14.29,39.69 14.29,45.4 15.56,46.67 15.56,47.15 15.72,47.31 17.3,47.31 S1.2 | v36.35,47.31 37.94,47.31 S2.2 38.1,47.31 39.69,47.31 44.96,42.07 v46.2,42.07 | v33.97,44.93 33.81,45.09 30.8,45.09 27.94,47.94 19.68,47.94 19.05,47.31 18.26,47.31 S1.2 | v23.02,1.27 23.18,1.11 24.45,1.11 24.45,1.91 U5.1 24.45,2.06 24.45,3.33 25.97,4.83 27.62,4.83 28.48,5.81 32,5.81 31.91,5.71 32.07,5.71 | U3.1 15.88,2.06 15.88,0.64 15.72,0.48 14.76,0.48 v14.61,0.64 14.45,0.64 14.29,0.48 7.81,0.48 7.81,6.67 v3.33,6.67 | 32.07,5.71 32.07,8.1 32.23,8.26 33.5,8.26 LED2.MINUS | 32.07,5.71 32.54,5.24 33.5,5.24 33.66,5.08 33.66,4.76 | 33.66,4.76 33.66,4.13 R4.1 | 36.04,4.76 36.04,4.13 C6.2 | 33.66,4.76 36.04,4.76 | 39.29,5.16 39.21,5.24 37.15,5.24 36.67,4.76 36.04,4.76 | 39.29,5.16 39.53,4.92 39.53,4.13 40.48,3.17 40.96,3.17 U2.2 41.12,3.17 42.61,3.17 42.61,5.52 43.94,6.86 45.59,6.86 46.99,8.26 v46.99,10.73 | 39.29,5.16 39.53,5.4 40.64,5.4 43.97,8.73 43.97,10.48 CN3.2 | 19.84,7.94 19.84,9.05 C7.2 | 19.84,7.94 19.84,7.78 19.68,7.62 19.05,7.62 17.78,6.35 17.46,6.35 17.46,7.46 C2.2 | v15.4,10.79 15.56,10.64 15.56,9.53 14.76,9.53 C3.2 14.61,9.53 13.02,9.53 12.86,9.37 11.91,9.37 C4.2 11.91,9.53 11.91,10.79 12.06,10.95 v12.22,10.95 | X1.2 21.27,14.92 20.48,14.92 19.53,13.97 19.53,12.54 | v9.84,12.06 8.26,12.06 CN1.GND 7.94,12.06 7.02,12.06 6.48,12.38 5.91,12.79 v2.35,12.79 | 19.84,7.94 20.64,7.94 v20.8,8.1
  Top 0.381: v22.7,8.89 22.86,9.05 22.86,11.59 21.91,12.54 19.53,12.54 | 23.1,19.61 23.65,19.05 23.65,17.78 23.81,17.62 U1.3 25.4,17.62 26.67,17.62 26.83,17.46 | 23.1,19.61 22.54,20.16 21.75,20.16 C5.2 | 26.83,17.46 26.83,16.19 26.67,16.03 25.4,16.03 U1.5 | v31.59,18.57 31.75,18.41 31.75,17.3 32.23,16.83 33.81,16.83 U1.21 | v29.84,17.78 27.15,17.78 26.83,17.46 | 4.6,26.73 8.98,26.73 14.84,20.88 | 4.6,26.73 2.03,26.73 CN4.1 | 14.84,20.88 15.24,20.48 16.83,20.48 R5.1 | v23.34,19.84 23.1,19.61 | 14.84,20.88 v15.4,21.43 | v8.73,37.31 11.11,39.69 12.54,39.69 RF2.GND | v5.08,37.47 5.24,37.31 5.24,35.08 4.45,34.29 4.45,27.94 4.6,27.78 4.6,26.73 | 19.53,12.54 19.49,12.54 19.49,12.32 18.54,11.37 18.35,11.34 v18.1,11.34
  Bottom 0.381: v20.32,38.89 20.32,39.85 21.43,40.96 23.5,40.96 23.65,41.12 v23.65,42.07 | v33.97,44.93 v36.35,47.31 | v46.2,42.07 46.2,39.37 46.51,39.05 46.51,35.56 47.62,34.45 47.62,33.66 ICSP1.6 | v14.61,0.64 14.76,0.64 14.92,0.48 22.23,0.48 v23.02,1.27 | v46.99,10.73 47.47,10.73 SJ3.1 | v18.1,11.34 15.43,11.34 v15.4,10.79 | v9.84,12.06 10.64,12.06 11.43,11.27 11.91,11.27 v12.22,10.95 | v20.8,8.1 21.91,8.1 v22.7,8.89 | v31.59,18.57 30.8,17.78 v29.84,17.78 | v23.34,19.84 23.18,19.68 21.11,19.68 18.73,22.07 15.88,22.07 15.4,21.59 v15.4,21.43 | CN4.1 1.91,26.67 3.9,24.61 3.9,19.84 3.33,19.21 2.32,18.29 v2.35,12.79 2.44,8.54 3.3,8.54 3.3,7.24 v3.33,6.67 | v8.73,37.31 8.57,37.47 v5.08,37.47
HV_LED
  Top 0.381: R8.2 10.79,18.55 | R9.1 6.38,20.83 5.52,20.83 4.83,20.13 4.83,17.84 5.91,16.76 9.53,16.76 9.53,17.59 10.49,18.55 10.79,18.55 | 10.79,18.55 Q2.3
LED-MID-1  (via drill 0.3)
  Top 0.305: v25.56,27.15 29.53,27.15 v30.64,28.26 30.48,28.26 30.48,28.89 31.59,30 34.61,30 v34.77,29.84
  Bottom 0.305: v30.64,28.26 32.23,28.26 L6.4-DIN | v25.56,27.15 25.56,25.4 SJ4.2 | v34.77,29.84 34.77,30.48 35.72,31.43 37.47,31.43 L5.2-DOUT
LED-MID-2  (via drill 0.3)
  Top 0.305: v24.77,25.4 22.23,25.4 22.07,25.24 21.43,25.24 21.11,25.56 v21.11,26.51 | v19.68,28.1 19.68,28.57 16.83,31.43 v15.88,31.43
  Bottom 0.305: L8.4-DIN 12.06,28.26 13.18,28.26 13.18,29.21 15.4,31.43 v15.88,31.43 17.14,31.43 L7.2-DOUT | v24.77,25.4 SJ5.1 | v21.11,26.51 21.11,26.67 v19.68,28.1
LED-MID-3  (via drill 0.3)
  Top 0.305: v24.61,24.13 25.88,25.4 28.57,25.4 30.48,27.3 v30.64,27.3 | v34.61,23.18 34.61,23.02 36.51,21.11 37.31,21.11 37.78,21.59 37.78,22.07 v37.62,22.23
  Bottom 0.305: L10.4-DIN 32.38,17.46 34.13,17.46 35.56,18.89 35.56,19.68 36.51,20.64 37.47,20.64 L9.2-DOUT 37.62,20.8 v37.62,22.23 | v24.61,24.13 23.18,24.13 23.02,24.29 23.02,25.4 SJ5.2 | v30.64,27.3 30.8,27.15 32.23,27.15 32.54,26.83 32.54,25.72 34.61,23.65 v34.61,23.18
LED-OUT-1  (via drill 0.3)
  Top 0.305: v36.2,42.23 36.2,41.43 v35.4,40.64
  Bottom 0.305: 35.32,38.66 35.08,38.89 34.13,38.89 33.97,39.05 32.38,39.05 L2.4-DIN | 35.32,38.66 35.4,38.58 35.4,36.83 SJ6.1 | v36.2,42.23 37.47,42.23 L1.2-DOUT | v35.4,40.64 35.4,38.73 35.32,38.66
LED-OUT-2  (via drill 0.3)
  Top 0.305: v15.88,42.23 15.88,41.43 v15.08,40.64
  Bottom 0.305: v15.88,42.23 17.14,42.23 L3.2-DOUT 17.3,42.23 18.89,42.23 19.05,42.07 19.37,42.07 20.8,43.5 28.73,43.5 28.89,43.34 28.89,40.16 31.27,37.78 34.13,37.78 34.45,37.47 34.45,36.83 SJ6.2 | v15.08,40.64 15.08,39.05 14.61,38.58 13.97,38.58 13.49,39.05 12.06,39.05 L4.4-DIN
LED-OUT-3  (via drill 0.3)
  Top 0.305: v39.05,31.59 38.89,31.43 30.48,31.43 29.37,32.54 v24.45,32.54 | v21.59,33.18 19.21,35.56 17.62,35.56 | v15.4,35.56 17.62,35.56 | v16.67,44.77 16.67,44.29 v20.16,40.8 | v19.21,39.85 19.21,38.26 v18.89,37.94 | 17.62,35.56 v17.62,36.99
  Bottom 0.305: v39.05,31.59 40.96,29.69 40.96,28.73 41.43,28.26 42.39,28.26 L5.4-DIN | v24.45,32.54 23.65,32.54 23.02,33.18 v21.59,33.18 | v15.4,35.56 15.24,35.56 15.08,35.72 15.08,36.83 SJ7.1 | v16.67,44.77 10.64,44.77 10.32,44.45 10.32,43.97 8.57,42.23 7.14,42.23 L4.2-DOUT | v19.21,39.85 v20.16,40.8 | v18.89,37.94 18.41,37.47 18.1,37.47 v17.62,36.99
LED-OUT-4  (via drill 0.3)
  Top 0.305: v8.67,21.02 9.84,22.07 v9.84,22.23 | v12.38,24.45 12.22,24.45 9.05,27.62 9.05,32.07 v10.64,33.66 | v9.21,8.57 9.37,8.41 9.37,7.78 9.21,7.62 v2.54,7.62 | v3.11,23.65 3.33,23.81 v6.03,23.81
  Bottom 0.305: v8.67,21.02 8.7,20.77 8.7,20.64 7.14,20.64 L12.2-DOUT 6.99,20.64 5.87,20.64 5.87,23.65 v6.03,23.81 | v9.84,22.23 12.06,24.45 v12.38,24.45 | v10.64,33.66 12.7,35.72 13.97,35.72 14.13,35.88 14.13,36.83 SJ7.2 | v9.21,8.57 10.16,8.57 10.32,8.73 11.11,8.73 11.27,8.57 14.92,8.57 15.56,7.94 18.57,7.94 21.59,4.92 22.23,4.92 24.77,2.38 29.72,2.38 30.19,2.86 41.88,2.86 41.88,6.51 L13.4-DIN | v2.54,7.62 1.62,7.59 1.62,18.83 3.27,20.35 3.27,23.5 v3.11,23.65
LED-OUT-5  (via drill 0.3)
  Top 0.305: v36.2,9.84 35.88,10.16 32.38,10.16 30.96,8.73 30.96,7.62 v30.8,7.46
  Bottom 0.305: SJ8.1 35.4,3.81 35.4,5.08 33.81,6.67 32.38,6.67 L14.4-DIN 32.23,6.67 31.27,6.67 30.8,7.14 v30.8,7.46 | v36.2,9.84 37.47,9.84 L13.2-DOUT
LED-OUT-6  (via drill 0.3)
  Top 0.305: v9.21,10 11.43,12.22 v11.43,12.38 | v29.05,13.34 28.89,13.49 v26.35,13.49 | v19.88,11.62 19.84,11.62 18.54,10.57 v18.57,10.57
  Bottom 0.305: v9.21,10 9.05,9.84 9.05,9.37 8.57,8.89 8.57,8.26 8.89,7.94 9.21,7.94 10.48,6.67 11.91,6.67 L16.4-DIN | v11.43,12.38 11.43,12.22 11.75,11.91 12.54,11.91 14.61,9.84 17.14,9.84 L15.2-DOUT 17.3,9.84 18.41,9.84 18.57,10 v18.57,10.57 | v29.05,13.34 29.05,6.67 30.48,5.24 34.29,5.24 34.45,5.08 34.45,3.81 SJ8.2 | v26.35,13.49 26.35,13.34 24.64,11.62 v19.88,11.62
LED_DATA  (via drill 0.3)
  Top 0.305: v43.34,35.24 43.34,33.66 42.07,32.38 v42.07,30.48 | v43.97,23.65 v43.97,28.57 | v45.4,20 v43.81,20 | v26.19,26.51 25.24,26.51 23.81,27.94 v23.81,29.05 | v15.72,30.64 v16.99,29.37 | v6.19,30.45 6.35,30.48 6.35,40.01 10.16,43.81 10.16,48.42 10.79,49.05 39.53,49.05 v40.16,48.42 | v44.77,40.32 44.61,40.48 43.66,40.48 v43.18,40.01
  Top 0.381: R9.2 7.33,22.57 v7.37,22.35
  Bottom 0.305: 43.34,39.05 42.55,39.05 L1.4-DIN | v43.34,35.24 43.34,39.05 | v43.97,28.57 v42.07,30.48 | v43.97,23.65 43.97,20.16 v43.81,20 | v45.4,20 45.24,19.84 45.24,19.05 R6.2 | v26.19,26.51 26.35,26.51 26.51,26.35 26.51,25.4 SJ4.1 | v23.81,29.05 22.7,30.16 20.8,30.16 20.64,30.32 19.68,30.32 18.89,29.53 17.14,29.53 v16.99,29.37 | v15.72,30.64 15.4,30.64 13.65,28.89 13.65,27.3 13.34,26.99 10.95,26.99 7.49,30.45 v6.19,30.45 | v40.16,48.42 40.16,47.28 44.77,42.67 v44.77,40.32 | v43.18,40.01 43.34,39.85 43.34,39.05
  Bottom 0.381: v7.37,22.35 7.37,23.43 6.03,24.77 6.03,27.18 5.84,27.37 5.84,28.96 6.6,29.46 6.6,29.91 v6.19,30.45
LED_NEG  (via drill 0.3)
  Top 0.381: v19.21,5.08 22.86,5.08 v23.02,5.24 | v8.64,4.67 10,6.35 10,9.21 v9.84,9.37 | v24.13,7.3 23.5,7.94 23.5,9.68 v23.65,9.84 | v33.02,33.97 33.18,33.81 33.97,33.81 34.61,34.45 36.04,34.45 v37.78,36.2 | v7.56,36.2 7.56,37.47 11.37,41.27 v11.94,41.27 | v27.62,37.91 27.62,41.21 v32.26,41.21
  Bottom 0.381: 15.88,40.96 14.61,42.23 12.06,42.23 L4.3-GND 11.94,42.25 v11.94,41.27 | 15.88,40.96 19.21,40.96 20.48,42.23 22.07,42.23 L3.3-GND | C9.2 29.37,36.2 29.37,37.18 29.34,37.21 28.32,37.21 v27.62,37.91 | 19.21,32.86 19.21,32.7 20.48,31.43 22.07,31.43 L7.3-GND 22.23,31.43 24.61,31.43 26.04,32.86 29.37,32.86 29.37,32.7 30.64,31.43 32.23,31.43 L6.3-GND 32.38,31.43 33.18,31.43 33.18,33.81 v33.02,33.97 | 19.21,32.86 19.21,36.2 C10.2 17.3,36.2 15.72,37.78 15.72,40.16 15.88,40.32 15.88,40.96 | 19.21,32.86 15.88,32.86 14.45,31.43 12.06,31.43 L8.3-GND | 39.37,40.96 39.53,40.96 40.8,42.23 42.39,42.23 L1.3-GND | 39.37,40.96 36.2,40.96 34.92,42.23 32.38,42.23 L2.3-GND 32.26,42.25 v32.26,41.21 | C8.2 39.53,36.2 39.53,32.7 40.8,31.43 42.39,31.43 L5.3-GND 42.55,31.43 43.97,31.43 45.56,29.84 | 45.56,29.84 C24.C | 39.37,40.96 39.37,36.35 C8.2 | C12.2 39.53,25.4 39.53,24.77 40.64,23.65 | 40.64,23.02 40.64,20.8 40.8,20.64 42.39,20.64 L9.3-GND | 40.64,23.02 40.64,23.65 | C13.2 29.37,25.4 29.37,22.07 | 29.37,22.07 29.37,21.91 30.64,20.64 32.23,20.64 L10.3-GND 32.38,20.64 33.97,20.64 34.13,20.48 34.61,20.48 37.15,23.02 40.64,23.02 | 29.37,22.07 26.04,22.07 24.61,20.64 22.23,20.64 L11.3-GND 22.07,20.64 21.11,20.64 20.48,21.27 20.48,23.34 19.21,24.61 19.21,25.4 C14.2 16.51,25.4 14.13,23.02 12.06,23.02 11.59,22.54 11.59,20.8 L12.3-GND 11.91,20.64 10.32,20.64 | SJ3.2 44.45,9.53 44.13,9.84 42.55,9.84 L13.3-GND 42.39,9.84 41.12,9.84 39.53,11.43 39.53,14.61 C16.2 37.78,14.61 33.97,10.79 33.97,9.84 | C20.2 37.62,3.81 34.13,7.3 34.13,9.68 33.97,9.84 | 33.97,9.84 32.38,9.84 L14.3-GND 32.23,9.84 30.64,9.84 29.69,10.79 29.69,12.86 29.84,13.02 29.84,13.81 29.21,14.45 29.21,14.61 29.05,14.76 C17.2 27.62,14.61 27.15,14.13 27.15,13.18 23.81,9.84 v23.65,9.84 22.23,9.84 L15.3-GND 22.07,9.84 20.32,9.84
  Bottom 0.381: C22.2 19.21,3.81 v19.21,5.08 | v23.02,5.24 23.02,5.08 25.08,3.02 26.67,3.02 27.46,3.81 | C21.2 27.46,3.81 | C15.2 9.05,25.4 9.05,21.91 10.32,20.64 | 20.32,9.84 20,9.84 18.73,8.57 15.88,8.57 15.24,9.21 14.29,9.21 13.65,9.84 12.06,9.84 L16.3-GND 11.91,9.84 10.32,9.84 | v8.64,4.67 C23.2 | 10.32,9.84 v9.84,9.37 | 10.32,9.84 10.32,10 7.3,13.02 7.3,14.45 7.46,14.61 C19.2 9.05,14.61 9.05,15.56 9.3,15.88 9.3,19.65 10.32,20.61 10.32,20.64 | C18.2 19.02,14.61 19.02,11.43 20.32,10 20.32,9.84 | v24.13,7.3 24.13,7.14 26.04,5.24 26.19,5.24 27.46,3.97 27.46,3.81 | 45.56,29.84 45.56,27.62 41.59,23.65 40.64,23.65 | C8.2 v37.78,36.2 | C11.2 v7.56,36.2
LED_POS  (via drill 0.3)
  Top 0.381: v31.75,24.61 32.7,25.56 33.18,25.56 v35.88,28.26 | v39.69,7.3 39.69,10.95 v41.43,12.7 | v42.23,25.4 42.07,25.24 42.07,24.45 43.66,22.86 44.45,22.86 v44.77,23.18 | v5.75,18.57 5.75,19.68 10.06,19.68 v10.06,19.18 | v25.72,6.67 22.86,3.81 v22.23,3.81 | v38.58,37.31 v40.48,37.31 | 14.61,36.2 14.92,36.2 v16.67,37.94 | 14.61,36.2 v12.06,36.2 | v36.2,39.05 33.34,36.2 v32.38,36.2 | v15.56,28.89 15.56,29.69 14.92,30.32 14.92,34.92 14.61,35.24 14.61,36.2 | v4.03,13.68 v0.89,13.68
  Bottom 0.381: C13.1 31.43,25.4 31.43,25.08 31.75,24.77 v31.75,24.61 | 33.81,29.53 33.97,29.53 35.24,28.26 v35.88,28.26 37.47,28.26 L5.1-VDD 37.62,28.26 38.89,28.26 40.32,26.83 40.32,26.51 40.48,26.35 40.48,25.4 C12.1 v42.23,25.4 | 33.81,29.53 30.8,29.53 29.53,28.26 27.46,28.26 L6.1-VDD | C20.1 40.48,3.81 40.48,5.4 39.21,6.67 | 39.21,6.67 37.62,6.67 L13.1-VDD | 46.12,14.37 46.04,14.29 46.04,13.65 46.51,13.18 46.51,12.7 SJ2.2 | 46.12,14.37 46.51,14.76 46.51,15.88 SJ1.2 46.51,16.03 46.51,17.62 46.35,17.78 44.93,17.78 44.61,18.1 44.61,22.86 44.85,23.1 | 41.43,14.61 42.55,14.61 42.7,14.45 46.04,14.45 46.12,14.37 | 41.43,14.61 C16.1 41.12,14.76 41.12,15.24 38.89,17.46 37.62,17.46 L9.1-VDD | 44.85,23.1 45.24,23.5 C24.A | v39.69,7.3 39.21,6.83 39.21,6.67 | 41.43,14.61 v41.43,12.7 | v44.77,23.18 44.85,23.1 | C17.1 30.32,14.61 30.32,16.19 29.05,17.46 27.46,17.46 L10.1-VDD 27.3,17.46 26.04,17.46 25.56,16.99 25.56,13.49 24.38,12.26 20.67,12.26 20.64,12.29 20.54,12.29 19.84,12.86 19.84,14.13 20.48,14.76 C18.1 20.64,14.61 20.64,15.91 18.89,17.65 17.24,17.65 L11.1-VDD 17.14,17.46 15.56,17.46 12.7,14.61 C19.1 10.06,14.61 v10.06,19.18 | v5.75,18.57 7.11,18.54 7.14,17.46 L12.1-VDD 6.99,17.46 6.19,17.46 3.75,17.49 3.75,13.68 | C21.1 30.32,3.81 30.32,4.45 28.1,6.67 27.46,6.67 L14.1-VDD 27.3,6.67 v25.72,6.67 | 21.27,3.81 C22.1 20.16,3.81 20.16,2.7 18.57,1.11 15.24,1.11 12.54,3.81 C23.1 10.48,3.81 10.48,4.92 8.73,6.67 7.14,6.67 L16.1-VDD 6.99,6.67 6.38,6.67 5.71,7.37 5.71,10.26 3.75,10.26 3.75,13.68 | 21.27,3.81 21.27,4.29 18.89,6.67 17.3,6.67 L15.1-VDD | 21.27,3.81 v22.23,3.81
  Bottom 0.381: L8.1-VDD 7.14,28.38 8.67,28.38 10.48,26.57 10.48,25.4 C15.1 12.22,25.4 13.18,26.35 13.65,26.35 15.56,28.26 | C14.1 20.16,25.4 20.16,26.67 19.53,27.3 19.37,27.3 18.41,28.26 17.3,28.26 L7.1-VDD 17.14,28.26 15.56,28.26 | C8.1 40.48,36.2 v40.48,37.31 | v38.58,37.31 38.73,37.47 38.73,39.05 37.62,39.05 L1.1-VDD 37.47,39.05 v36.2,39.05 | v12.06,36.2 C11.1 10,36.2 10,37.31 9.21,38.1 8.41,38.1 7.46,39.05 7.14,39.05 L4.1-VDD 6.99,39.05 5.71,39.05 3.59,40.8 0.79,40.8 0.48,40.48 0.48,17.46 0.51,17.46 0.51,13.65 v0.89,13.68 | v16.67,37.94 16.35,38.26 16.35,39.05 17.14,39.05 L3.1-VDD 17.3,39.05 18.89,39.05 20.16,37.78 20.16,36.2 C10.1 22.23,36.2 25.08,39.05 27.3,39.05 L2.1-VDD 27.46,39.05 29.05,39.05 30.8,37.31 30.8,36.2 C9.1 v32.38,36.2 32.38,36.04 33.81,34.61 33.81,29.53 | v15.56,28.89 15.56,28.26 | v4.03,13.68 3.75,13.68
N$1
  Top 0.381: U1.7 23.05,14.43 23.05,16.07 21.46,16.07 X1.1
N$2
  Top 0.305: R2.1 35.56,8.26 35.56,7.78 35.88,7.78 36.83,6.83 36.83,5.87 36.35,5.4 34.61,5.4 34.45,5.56 34.45,6.35 34.29,6.51 33.66,6.51 LED2.PLUS
N$3  (via drill 0.3)
  Top 0.305: v10.95,37.78 12.7,37.78 RF2.ANA | v16.67,43.34 20.32,39.69 22.07,39.69 RF1.ANT
  Bottom 0.305: v10.95,37.78 10.48,37.78 10.48,41.34 | 10.48,41.34 4.25,41.34 4.25,42.23 U$1.P$1 | v16.67,43.34 16.51,43.5 10.76,43.5 10.76,42.23 10.48,42.23 10.48,41.34
N$4
  Top 0.305: LED1.PLUS 1.59,22.7 3.81,22.7 R3.2
N$6
  Bottom 0.305: L3.4-DIN 22.23,39.05 24.13,39.05 25.56,40.48 25.56,42.07 25.72,42.23 27.3,42.23 L2.2-DOUT
N$10
  Bottom 0.305: L7.4-DIN 22.23,28.26 23.97,28.26 25.08,29.37 25.08,30.96 25.56,31.43 27.3,31.43 L6.2-DOUT
N$12  (via drill 0.3)
  Top 0.305: v5.4,31.43 5.08,31.11 5.08,28.26 6.03,27.43 8.26,27.43 v8.41,27.53 | v6.83,24.92 6.99,25.08 8.1,25.08 11.27,21.91 11.27,21.59 11.75,21.11 12.86,21.11 13.34,21.08 v13.4,21.05 | v19.68,22.7 20,23.02 20.32,23.02 21.11,23.81 23.02,23.81 25.72,21.11 25.72,20.32 27.62,18.41 29.37,18.41 29.53,18.57 30.16,18.57 30.64,18.1 30.64,17.46 28.89,15.72 v27.78,15.72 | v26.51,14.61 26.99,14.61 27.62,13.97 v31.91,13.97 | v35.72,16.03 36.35,16.03 36.83,15.56 37.47,15.56 40.01,18.1 v40.01,18.26
  Bottom 0.305: v5.4,31.43 6.99,31.43 L8.2-DOUT | v8.41,27.53 6.83,25.88 v6.83,24.92 | v13.4,21.05 13.43,21.08 13.49,21.11 14.29,21.91 14.76,21.91 15.56,22.7 v19.68,22.7 | v27.78,15.72 26.67,14.61 v26.51,14.61 | v31.91,13.97 32.23,14.29 33.34,14.29 35.08,16.03 v35.72,16.03 | v40.01,18.26 40.01,18.1 40.64,17.46 42.39,17.46 L9.4-DIN
N$14
  Bottom 0.305: L11.4-DIN 22.23,17.46 23.97,17.46 25.08,18.57 25.08,20.16 25.56,20.64 27.3,20.64 L10.2-DOUT
N$15
  Bottom 0.305: L12.4-DIN 12.06,17.46 13.34,17.46 13.34,20.16 14.03,20.16 14.03,20.64 17.14,20.64 L11.2-DOUT
N$18
  Bottom 0.305: L14.2-DOUT 27.3,9.84 25.56,9.84 22.23,6.51 L15.4-DIN
N$20  (via drill 0.3)
  Top 0.305: v8.57,32.7 8.57,30.64 v8.41,30.48 | v9.68,29.21 9.53,29.05 9.53,27.94 12.38,25.08 v13.02,25.08 | v14.92,25.08 14.92,24.92 18.57,21.27 19.21,21.27 19.37,21.11 19.37,20.48 C1.2
  Bottom 0.305: CN4.6 2.7,39.37 4.29,37.78 4.29,36.83 8.41,32.7 v8.57,32.7 | v8.41,30.48 8.41,30.32 9.53,29.21 v9.68,29.21 | v14.92,25.08 v13.02,25.08
N$21
  Top 0.305: U1.8 25.24,13.72 21.43,13.72 X1.3
PROG  (via drill 0.3)
  Top 0.305: v37.15,2.22 38.26,2.22 U2.5 | v34.77,2.22 33.81,2.22 33.66,2.06 33.5,2.22 R4.2
  Bottom 0.305: v37.15,2.22 36.99,2.38 34.92,2.38 v34.77,2.22
PWR  (via drill 0.3)
  Top 0.381: v47.53,11.56 47.78,11.49 47.78,6.99 v47.59,6.73 | v37.59,1.46 36.35,0.48 29.21,0.48 29.05,0.64 29.05,1.91 U5.3 29.05,2.06 29.05,3.33 28.57,3.81 v26.35,3.81 | 17.34,9.72 17.27,10.1 17.3,12.22 17.3,13.81 D1.C v15.68,13.84 | 17.34,9.72 17.46,9.37 C2.1 | 17.34,9.72 18.76,9.72 20,10.76 21.59,10.76 21.75,10.79 21.75,9.21 C7.1 21.75,9.05 21.75,7.78 21.59,7.62 | 13.18,2.7 v12.54,2.7 | 13.18,2.7 13.34,2.54 13.34,1.91 Q1.2 | 13.18,2.7 13.34,2.7 13.34,3.49 13.49,3.65 16.83,3.65 16.83,4.29 U3.3 16.83,4.45 16.83,5.56 16.99,5.71 18.1,5.71 19.37,6.99 20,6.99 20.32,7.3 21.27,7.3 21.59,7.62 | v23.65,6.51 22.7,6.51 21.59,7.62 | v15.68,16.51 14.85,16.51 R8.1
  Bottom 0.381: v47.53,11.56 47.5,11.43 47.47,12.22 47.47,12.7 SJ2.1 | v47.59,6.73 44.39,6.73 44.39,6.06 43.31,4.95 43.21,4.83 43.21,1.46 v37.59,1.46 | CN4.3 2.86,31.75 4.54,30 4.54,19.27 3.14,17.94 3.11,17.72 3.11,9.4 4.25,9.4 4.25,6.7 4.29,6.7 7.59,4.16 7.59,2.54 12.38,2.54 v12.54,2.7 | v26.35,3.81 26.35,3.97 23.81,6.51 v23.65,6.51 | v15.68,13.84 v15.68,16.51
RST  (via drill 0.3)
  Top 0.305: v43.18,32.54 43.34,32.38 43.34,30.8 36.83,24.29 32.7,24.29 v32.38,23.97 | U1.29 29.21,20.8 29.21,22.23 29.37,22.38 30.48,22.38 v30.64,22.23 30.64,22.38 32.86,22.38 37.15,18.1 v37.15,16.19 | v14.45,28.73 11.59,28.73 10.95,28.1 10.95,27.3 11.91,26.35 12.7,26.35 18.1,20.95 18.1,20.16 19.05,19.21 19.37,19.21 19.37,18.89 C1.1 | v19.68,31.11 20.64,31.11 21.11,30.64 23.18,30.64 23.81,31.27 23.81,32.86 24.77,33.81 29.69,33.81 31.11,32.38 34.92,32.38 37.31,34.77 v41.75,34.77 | v38.26,12.06 38.26,8.41 R1.2 | v38.26,13.34 38.26,14.76 39.21,15.72 v39.37,15.72
  Bottom 0.305: v43.18,32.54 43.58,32.94 | 43.58,32.94 44.13,33.5 45.09,33.5 ICSP1.5 | v30.64,22.23 v32.38,23.97 | v14.45,28.73 14.45,28.89 15.56,30 18.57,30 v19.68,31.11 | 43.58,32.94 v41.75,34.77 | v38.26,13.34 v38.26,12.06 | v39.37,15.72 38.89,16.19 v37.15,16.19
STAT  (via drill 0.3)
  Top 0.305: v2.51,20.95 1.59,20.95 LED1.MINUS | v2.48,24.92 2.7,24.77 5.24,24.77 v5.3,25.21 | v5.71,29.72 6.35,29.72 6.83,30 6.83,39.69 v11.27,44.13 | v45.4,32.07 45.4,28.42 v47.15,26.67 | v42.35,2.3 U2.1
  Bottom 0.305: v2.51,20.95 2.48,21.11 v2.48,24.92 | v5.3,25.21 5.3,29.69 v5.71,29.72 | v11.27,44.13 11.43,43.97 39.56,43.97 39.56,43.31 43.24,43.31 43.81,42.74 43.81,35.88 45.09,34.61 45.72,34.61 46.35,33.97 46.35,33.02 v45.4,32.07 | v47.15,26.67 49.05,24.77 49.05,7.94 48.58,7.46 43.69,7.46 43.69,6.22 43.18,5.68 42.45,5.68 42.45,2.22 v42.35,2.3
VBAT  (via drill 0.3)
  Top 0.305: U2.3 41.12,4.29 41.12,4.92 43.66,7.46 45.09,7.46 45.72,8.1 45.72,8.73 45.88,8.89 45.88,10.48 CN3.1 45.88,10.64 45.88,12.22 45.72,12.38 45.72,13.02 44.93,13.81 v44.93,15.24 | v16.19,12.22 16.19,6.99 15.88,6.35 13.49,6.35 12.38,5.24 12.38,3.97 Q1.3 | v18.16,12.22 18.61,12.64 18.61,15.05 19.43,16.32 19.43,17.78 20.48,17.78 20.48,19.05 20.16,19.37 20.16,21.27 20.95,22.07 20.95,22.23 21.27,22.54 v22.54,22.54 | v28.57,22.86 33.18,22.86 37.62,18.41 38.89,18.41 v39.05,18.26
  Bottom 0.305: v18.16,12.22 v16.19,12.22 | v22.54,22.54 25.56,22.54 25.72,22.7 28.42,22.7 v28.57,22.86 | v39.05,18.26 41.43,15.88 42.23,15.88 43.02,15.08 44.77,15.08 v44.93,15.24
VBUS  (via drill 0.3)
  Top 0.381: U2.4 38.26,4.13 37.47,4.13 37.31,3.97 37.31,3.49 36.2,2.38 C6.1 36.04,2.22 35.02,1.22 31.02,1.22 v30.86,1.27 | 12.86,15.34 8.26,15.34 CN1.VBUS 7.94,15.4 6.99,15.4 7.65,15.3 7.46,15.34 7.94,15.37 6.86,15.37 6.1,14.67 3.94,14.67 3.94,18.38 3.97,18.38 3.97,20.8 R3.1 | 12.86,15.34 13.02,15.24 13.02,13.97 D1.A 13.02,13.81 13.02,12.22 12.86,12.06 12.22,12.06 10.64,10.48 10.64,7.94 | 10.64,7.94 10.64,4.29 11.43,3.49 11.43,1.91 Q1.1 | 12.86,15.34 13.11,15.08 17.68,15.08 17.68,18.73 16.83,18.73 R5.2 | v22.7,3.02 20.16,3.02 v18.26,4.92 | v10.79,7.94 10.64,7.94
  Bottom 0.381: v30.86,1.27 30.07,0.48 25.72,0.48 23.18,3.02 v22.7,3.02 | v18.26,4.92 17.94,5.24 15.88,5.24 13.18,7.94 v10.79,7.94
VCC  (via drill 0.3)
  Top 0.305: RF1.VDD 22.16,37.18 28.1,37.18 30.48,39.69 32.07,39.69 RF2.VDD | ICSP1.2 45.4,40.96 36.51,40.96 36.04,40.48 36.04,40.32 35.56,39.85 33.97,39.85 33.81,39.69 32.23,39.69 RF2.VDD | 32.23,39.85 RF2.VDD | C3.1 14.61,7.46 13.02,7.46 12.86,7.62 11.91,7.62 C4.1 11.91,7.46 11.91,5.71 v11.75,5.56 | U5.2 26.67,1.91 26.67,0.64 26.51,0.48 17.94,0.48 17.78,0.64 17.78,2.06 U3.2 17.78,2.22 17.78,2.54 v18.89,2.54 | 23.81,16.67 23.81,15.4 23.97,15.24 U1.6 25.4,15.24 27.15,15.24 27.94,14.45 31.43,14.45 v31.91,14.92 | 23.81,16.67 23.97,16.83 U1.4 | v42.23,8.1 42.23,7.94 40.32,6.03 39.21,6.03 39.05,5.87 38.26,5.87 38.26,6.51 R1.1 38.26,6.67 38.26,7.14 37.47,7.14 v36.67,7.94 | 35.32,14.37 35.56,14.13 v35.56,11.27 | 35.32,14.37 35.24,14.45 33.97,14.45 U1.18 | v35.4,14.45 35.32,14.37 | 10.67,16.16 6.29,16.13 v6.29,15.97 | v22.86,18.41 23.02,18.26 23.02,17.46 23.81,16.67 | v48.9,31.91 49.05,31.75 49.05,19.21 v47.94,18.1
  Top 0.381: v12.32,16.16 10.67,16.16 Q2.1 | R7.1 18.62,17.45 18.35,17.72 18.35,18.99 17.78,19.56 16,19.56 15.75,19.3 v15.75,18.73
  Bottom 0.305: v18.89,2.54 18.89,2.38 18.26,1.75 15.56,1.75 v11.75,5.56 11.75,5.4 10.95,5.4 8.89,7.46 8.57,7.46 8.1,7.94 8.1,9.21 8.57,9.68 8.57,10.79 6.67,12.7 6.67,15.02 6.25,15.05 v6.29,15.97 | v42.23,8.1 42.39,7.94 48.26,7.94 48.58,8.26 48.58,13.97 48.42,14.13 47.78,14.13 47.47,14.45 47.47,15.88 | v35.56,11.27 35.56,9.05 v36.67,7.94 | v31.91,14.92 32.23,14.92 32.38,14.76 33.02,14.76 35.4,17.14 36.04,17.14 36.35,16.83 36.35,15.4 v35.4,14.45 | v12.32,16.16 12.54,16.19 13.34,16.19 15.56,18.41 | v15.75,18.73 17.78,18.73 17.94,18.57 22.7,18.57 v22.86,18.41 | ICSP1.2 49.05,37.31 49.05,32.07 v48.9,31.91 | v47.94,18.1 47.47,17.62 47.47,15.88 | 47.47,15.88 SJ1.1
  Bottom 0.381: v15.75,18.73 15.56,18.41

### Text on the board
tNames: LED Node / Richard Hawthorn / richardhawthorn.com | ANT | GRN | FTDI | BLK | RH005.1 / Oct 2014 | Charging
bNames: LED / OUT | LED / OUT | LED / IN | LED / IN | LED / 3.3v | or | Short LED OUT for outside 4 LEDs only | Short LED IN for inside 4 LEDs only | LED / VIN | LED / GND | LED / OUT
tDocu: REG